# EasyEDA Pro project 视觉车.eprj, board motor2
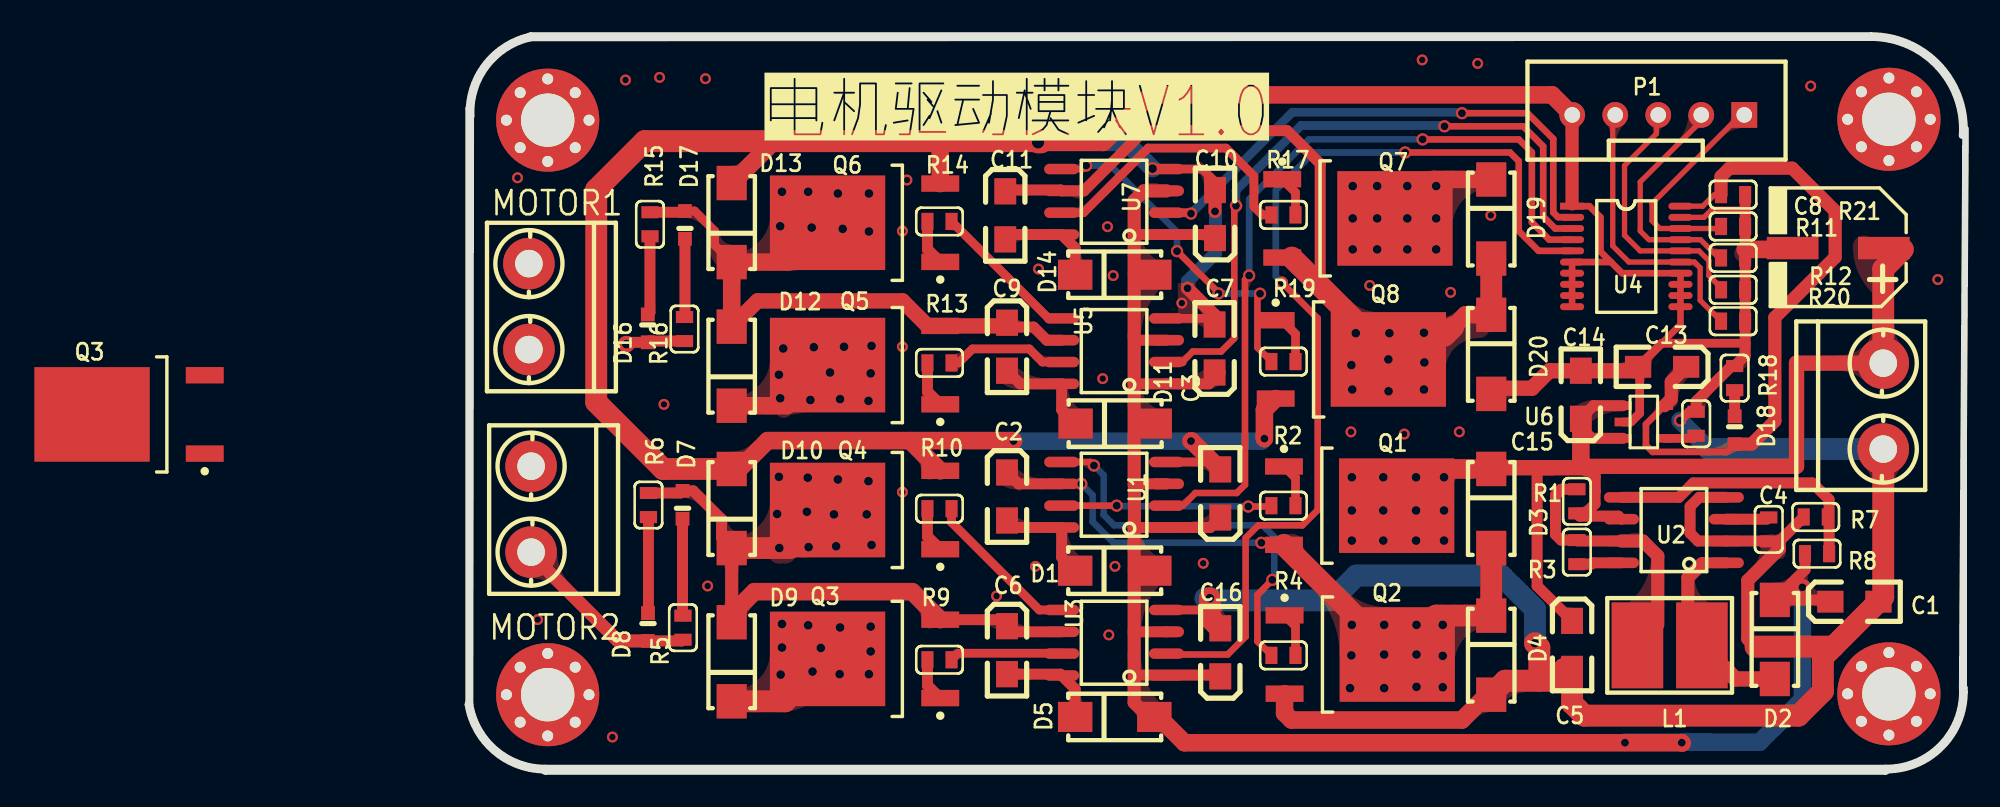
[diagram p3: board, top side]
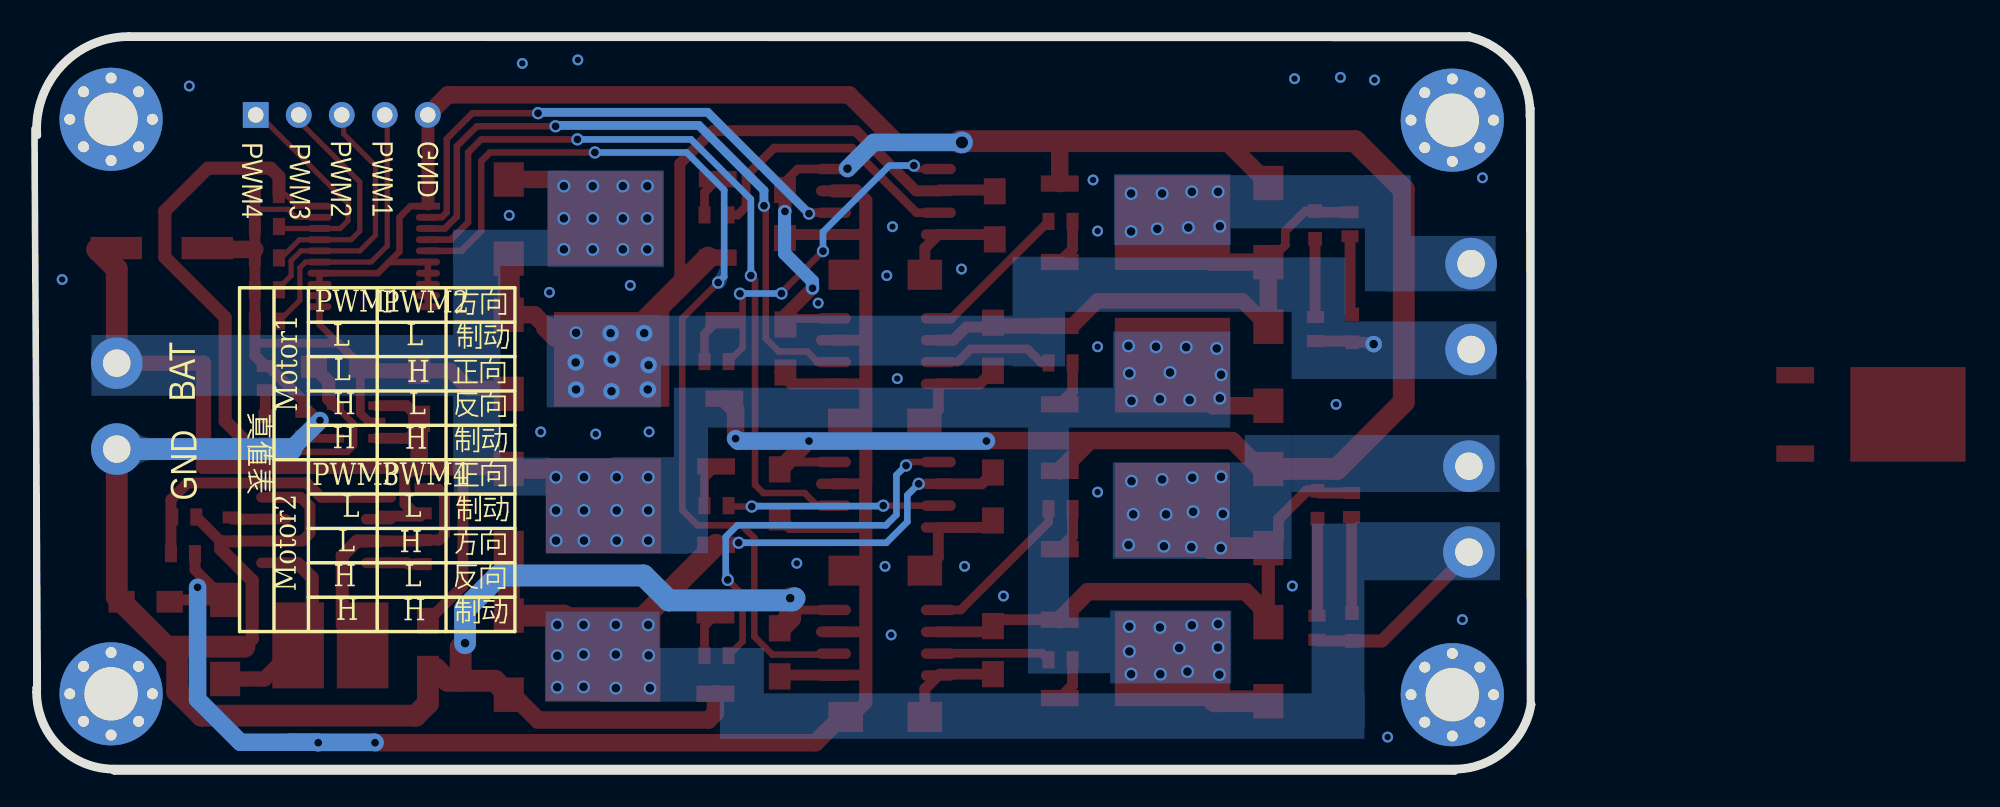
[diagram p4: board, bottom side, seen from below]

Outline 87.11 x 42.95 mm; copper layers: Top Layer, Bottom Layer. Coordinates in mm from the lower left corner of the outline.
Outline path: 0.23,38.62 0.19,3.98 arc(1.7,1.31) 4.57,0.27 82.45,0.27 arc(85.69,1.63) 86.91,4.92 87.11,37.45 ; 0.26,38.19 arc(1.16,41.1) 3.72,42.74 81.59,42.76 arc(85.49,41.07) 86.9,37.06 ; 87.11,37.45 arc(85.51,41.33) 81.64,42.95 arc(81.62,42.95) 81.61,42.95 3.72,42.95 arc(3.66,42.94) 3.6,42.91 arc(1.15,41.4) 0.07,38.72 arc(0.05,38.67) 0.04,38.62 0.04,4.1 arc(0,4.03) 0,3.95 arc(1.51,1.22) 4.42,0.08 arc(4.49,0.02) 4.57,0 82.45,0 arc(82.54,0.02) 82.61,0.08 arc(85.8,1.47) 87.11,4.69 arc(87.11,4.81) 87.1,4.93 arc(87.09,4.99) 87.06,5.04 87.06,36.95 arc(87.08,37) 87.09,37.05 arc(87.11,37.25) 87.11,37.45
Stack: Top Layer 0.0356mm / Dielectric1 0.32mm FR-4 er 4.8 / Bottom Layer 0.0356mm

## Design rules (mm)
spacing Clearance (default): track to track 0.203, other pairs 0 to 0.203
track width Width (default): min 0.254, default 0.305, max 3.048
track width POWER: min 0.254, default 0.508, max 5.08
track width GND: min 0.254, default 0.508, max 5.08
differential pair DiffPairsRouting (default): width min 0.381, default 0.381, max 0.381; gap min 0.254, default 0.254
via RoutingVias (default): diameter min 0.406, default 0.508, max 1.27; hole min 0.254, default 0.305, max 1.118

## Placement (name value [footprint] x y rotation side)
C1  Cap Pol1  [3216]  80.65 9.94 180 top
C2  1.5uF  [3216]  31.4 16.07 90 top
C3  Cap Pol1  [3216]  43.79 16.24 270 top
C4  470pF  [0603AR]  75.67 13.45 90 top
C5  Cap Pol1  [3216]  64.24 7.43 90 top
C6  1.5uF  [3216]  31.4 7.12 90 top
C7  Cap Pol1  [3216]  43.46 24.68 270 top
C8  100nF  [0603AR]  74.3 33.63 180 top
C9  1.5uF  [3216]  31.4 24.78 90 top
C10  Cap Pol1  [3216]  43.49 32.5 270 top
C11  1.5uF  [3216]  31.29 32.42 90 top
C13  10uF  [3216]  69.47 23.61 0 top
C14  10uF  [3216]  64.75 21.98 270 top
C15  470pF  [0603AR]  71.45 19.6 90 top
C16  Cap Pol1  [3216]  43.79 7 270 top
D1  IN5819  [DO-214  贴片二极管]  39.96 11.75 180 top
D2  IN5819  [DO-214  贴片二极管]  76.02 5.45 90 top
D3  IN5819  [DO-214  贴片二极管]  59.54 13.07 90 top
D4  IN5819  [DO-214  贴片二极管]  59.54 4.53 90 top
D5  IN5819  [DO-214  贴片二极管]  39.96 3.24 180 top
D7  RED  [LED_0603]  12.59 16.73 270 top
D8  RED  [LED_0603]  10.48 7.33 90 top
D9  IN5819  [DO-214  贴片二极管]  15.39 8.75 270 top
D10  IN5819  [DO-214  贴片二极管]  15.39 17.67 270 top
D11  IN5819  [DO-214  贴片二极管]  39.98 20.31 180 top
D12  IN5819  [DO-214  贴片二极管]  15.39 25.95 270 top
D13  IN5819  [DO-214  贴片二极管]  15.39 34.3 270 top
D14  IN5819  [DO-214  贴片二极管]  39.96 28.97 180 top
D16  RED  [LED_0603]  10.47 24.7 90 top
D17  RED  [LED_0603]  12.73 33.01 270 top
D18  RED  [LED_0603]  73.64 18.78 90 top
D19  IN5819  [DO-214  贴片二极管]  59.54 29.91 90 top
D20  IN5819  [DO-214  贴片二极管]  59.54 22.03 90 top
DESIGNATOR19  -  [CAP6.3X7.7]  79.71 30.52 180 top
L1  Inductor  [屏蔽电感5X5]  70.28 7.4 0 top
MOTOR1  Motor  [Con 2接线端子]  3.61 27.12 270 top
MOTOR2  Motor  [Con 2接线端子]  3.74 15.33 270 top
NOREF  -  [Mech Hole 1_1]  4.7 4.53 270 top
NOREF#2  -  [Mech Hole 1_3]  4.7 37.96 270 top
NOREF#3  -  [Con 2接线端子]  82.32 21.32 90 top
NOREF#4  -  [Mech Hole 1_2]  82.65 38.01 270 top
NOREF#5  -  [Mech Hole 1]  82.65 4.59 270 top
P1  Header 5  [CZ5-2.54]  74.25 38.27 180 top
Q1  -  [TO-252  mos管]  51.89 15.53 0 top
Q2  -  [TO-252  mos管]  51.93 6.87 0 top
Q3  -  [TO-252  mos管]  23.12 6.62 180 top
Q3#2  -  [TO-252  mos管]  -19.63 20.84 180 top
Q4  -  [TO-252  mos管]  23.12 15.28 180 top
Q5  -  [TO-252  mos管]  23.12 23.71 180 top
Q6  -  [TO-252  mos管]  23.12 31.99 180 top
Q7  -  [TO-252  mos管]  51.79 32.25 0 top
Q8  IR7843  [TO-252  mos管]  51.41 24.04 0 top
R1  Res2  [0603AR]  64.52 15.09 90 top
R2  Res2  [0603AR]  46.76 15.53 0 top
R3  Res2  [0603AR]  64.52 12.13 90 top
R4  Res2  [0603AR]  46.76 6.82 0 top
R5  Res2  [0603AR]  12.56 9.13 270 top
R6  Res2  [0603AR]  10.56 16.27 270 top
R7  Res2  [0603AR]  77.7 14.87 0 top
R8  Res2  [0603AR]  77.78 12.74 0 top
R9  Res2  [0603AR]  28.17 6.57 180 top
R10  Res2  [0603AR]  28.17 15.35 180 top
R11  Res2  [0603AR]  74.3 31.78 180 top
R12  Res2  [0603AR]  74.3 29.95 180 top
R13  Res2  [0603AR]  28.17 23.84 180 top
R14  Res2  [0603AR]  28.17 32.07 180 top
R15  Res2  [0603AR]  10.64 31.2 90 top
R16  Res2  [0603AR]  12.65 25.11 90 top
R17  Res2  [0603AR]  46.76 32.45 0 top
R18  Res2  [0603AR]  73.69 23.65 270 top
R19  Res2  [0603AR]  46.76 23.91 0 top
R20  Res2  [0603AR]  74.3 28.09 180 top
R21  Res2  [0603AR]  74.3 26.26 180 top
U1  IR2104S  [SO8NB]  37.62 16.17 90 top
U2  MC34063  [SO8NB]  70.16 14.11 90 top
U3  IR2104S  [SO8NB]  37.62 7.56 90 top
U4  74lvc245  [74lvc245 TSSOP]  64.24 32.96 0 top
U5  IR2104S  [SO8NB]  37.62 24.52 90 top
U6  MIC5219  [SOT23-5 - duplicate]  67.21 21.35 90 top
U7  IR2104S  [SO8NB]  37.62 33.21 90 top

## Footprints (pads in the part's own frame, mm; a bottom-side part is the same pattern mirrored in y, then rotated)
74lvc245 TSSOP
  rect 1.4x0.4 smd: 1(0,0)
  oval 1.4x0.4 smd: 2(0,-0.65) 3(0,-1.3) 4(0,-1.95) 5(0,-2.6) 6(0,-3.25) 7(0,-3.9) 8(0,-4.55) 9(0,-5.2) 10(0,-5.85) 11(6.3,-5.85) 12(6.3,-5.2) 13(6.3,-4.55) 14(6.3,-3.9) 15(6.3,-3.25) 16(6.3,-2.6) 17(6.3,-1.95) 18(6.3,-1.3) 19(6.3,-0.65) 20(6.3,0)
0603AR
  rect 0.7x1 smd: 1(0,0) 2(1.4,0)
3216
  rect 1.524x1.27 smd: 1(1.397,0) 2(-1.397,0)
CAP6.3X7.7
  rect 3x1.3 smd: 1(-2.65,0) 2(2.65,0)
Con 2接线端子
  round 3 hole 1.6: 1(-2.5,0) 2(2.5,0)
CZ5-2.54
  rect 1.5x1.5 hole 0.9: 1(0,0)
  round 1.5 hole 0.9: 2(2.5,0) 3(5,0) 4(7.5,0) 5(10,0)
DO-214  贴片二极管
  rect 2x1.75 smd: 1(0,0) 2(4.6,0)
LED_0603
  rect 0.8x0.8 smd: 1(0.333,-0.051) 2(1.953,-0.051)
Mech Hole 1
  round 0.635 hole 0.635: 1(-2.4,0) 1(-1.6,1.6) 1(-1.6,-1.6) 1(0,2.4) 1(0,-2.4) 1(1.6,1.6) 1(1.6,-1.6) 1(2.4,0)
  round 6 hole 3.1: 3(0,0)
Mech Hole 1_1
  round 0.635 hole 0.635: 1(-2.4,0) 1(-1.6,1.6) 1(-1.6,-1.6) 1(0,2.4) 1(0,-2.4) 1(1.6,1.6) 1(1.6,-1.6) 1(2.4,0)
  round 6 hole 3.1: 4(0,0)
Mech Hole 1_2
  round 0.635 hole 0.635: 1(-2.4,0) 1(-1.6,1.6) 1(-1.6,-1.6) 1(0,2.4) 1(0,-2.4) 1(1.6,1.6) 1(1.6,-1.6) 1(2.4,0)
  round 6 hole 3.1: 2(0,0)
Mech Hole 1_3
  round 0.635 hole 0.635: 1(-2.4,0) 1(-1.6,1.6) 1(-1.6,-1.6) 1(0,2.4) 1(0,-2.4) 1(1.6,1.6) 1(1.6,-1.6) 1(2.4,0)
  round 6 hole 3.1: 1(0,0)
SO8NB
  oval 0.61x2.032 smd: 1(-1.905,-3.048) 2(-0.635,-3.048) 3(0.635,-3.048) 4(1.905,-3.048) 5(1.905,3.048) 6(0.635,3.048) 7(-0.635,3.048) 8(-1.905,3.048)
SOT23-5 - duplicate
  rect 0.5x1 smd: 1(0,0) 2(-0.95,0) 3(-1.9,0) 4(-1.9,-2.4) 5(0,-2.4)
TO-252  mos管
  rect 2.2x0.95 smd: 1(-4.4,2.28) 3(-4.4,-2.28)
  rect 6.7x5.5 smd: 4(2.15,0)
屏蔽电感5X5
  rect 3x5 smd: 1(-2.25,0) 2(1.5,0)

## Nets
3.3V: C8.2 C13.1 D18.1 U4.20 U6.5
12V: C1.1 C3.1 C7.1 C10.1 C16.1 D1.1 D2.2 D5.1 D11.1 D14.1 R8.1 U1.1 U1.3 U3.1 U3.3 U5.1 U5.3 U7.1 U7.3
GND: C1.2 C3.2 C4.1 C5.2 C7.2 C8.1 C10.2 C13.2 C14.2 C15.2 C16.2 D4.1 D10.1 D13.1 D20.1 DESIGNATOR19.2 NOREF#3.1 P1.5 Q2.3 Q4.3 Q6.3 Q8.3 R7.1 R11.1 R12.1 R18.1 R20.1 R21.1 U1.4 U2.2 U2.4 U3.4 U4.1 U4.6 U4.7 U4.8 U4.9 U4.10 U4.11 U4.12 U4.13 U4.14 U4.19 U5.4 U6.2 U7.4
BAT: C5.1 C14.1 D3.2 D9.2 D12.2 D19.2 DESIGNATOR19.1 NOREF#3.2 Q1.4 Q3.4 Q3#2.4 Q5.4 Q7.4 R1.1 U2.6 U6.1 U6.3
MOTOR IN1: U4.3 U5.2
MOTOR IN2: U4.2 U7.2
MOTOR IN3: U1.2 U4.4
MOTOR IN4: U3.2 U4.5
NETB1_1: C2.1 D3.1 D4.2 D8.1 MOTOR2.2 Q1.3 Q2.4 R5.2 U1.6
NETB1_2: C6.1 D7.1 D9.1 D10.2 MOTOR2.1 Q3.3 Q3#2.3 Q4.4 R6.1 U3.6
NETB2_1: C9.1 D12.1 D13.2 D17.1 MOTOR1.1 Q5.3 Q6.4 R15.2 U5.6
NETB2_2: C11.1 D16.1 D19.1 D20.2 MOTOR1.2 Q7.3 Q8.4 R16.1 U7.6
NETC2_2: C2.2 D1.2 U1.8
NETC4_2: C4.2 U2.3
NETC6_2: C6.2 D5.2 U3.8
NETC9_2: C9.2 D11.2 U5.8
NETC11_2: C11.2 D14.2 U7.8
NETC15_1: C15.1 U6.4
NETD2_1: D2.1 L1.2 U2.1
NETD7_2: D7.2 R5.1
NETD8_2: D8.2 R6.2
NETD16_2: D16.2 R15.1
NETD17_2: D17.2 R16.2
NETD18_2: D18.2 R18.2
NETL1_1: L1.1 R1.2 R3.2 U2.7
NETQ1_1: Q1.1 R2.2
NETQ2_1: Q2.1 R4.2
NETQ3_1: Q3.1 Q3#2.1 R9.2
NETQ4_1: Q4.1 R10.2
NETQ5_1: Q5.1 R13.2
NETQ6_1: Q6.1 R14.2
NETQ7_1: Q7.1 R17.2
NETQ8_1: Q8.1 R19.2
NETR2_1: R2.1 U1.7
NETR3_1: R3.1 U2.8
NETR4_1: R4.1 U1.5
NETR7_2: R7.2 R8.2 U2.5
NETR9_1: R9.1 U3.7
NETR10_1: R10.1 U3.5
NETR13_1: R13.1 U5.7
NETR14_1: R14.1 U5.5
NETR17_1: R17.1 U7.7
NETR19_1: R19.1 U7.5
PWM1: P1.4 R21.2 U4.15
PWM2: P1.3 R20.2 U4.16
PWM3: P1.2 R12.2 U4.17
PWM4: P1.1 R11.2 U4.18

Pads without a net: NOREF 1 4; NOREF#2 1; NOREF#4 1 2; NOREF#5 1 3

## Via types
v1: diameter 0.635, hole 0.381, Top Layer to Bottom Layer, 32 vias
v2: diameter 0.711, hole 0.457, Top Layer to Bottom Layer, 24 vias
v3: diameter 0.965, hole 0.508, Top Layer to Bottom Layer, 11 vias
v4: diameter 0.762, hole 0.508, Top Layer to Bottom Layer, 80 vias
v5: diameter 1.27, hole 0.711, Top Layer to Bottom Layer, 1 via
v6: diameter 0.965, hole 0.457, Top Layer to Bottom Layer, 3 vias

## Routing (per net, layer and track width the routed paths; a pad name or vN(x,y) marks a point on that pad's centre or on a via; arc(x,y) is an arc through that point)
3.3V: length 38.8
  Top Layer w0.305: 72.51,33.63 71.83,32.96 70.54,32.96
  Top Layer w0.381: U6.5 68.53,20.27 68.53,19.05 68.93,18.66 73.23,18.66 D18.1
  Top Layer w0.762: D18.1 74.67,19.11 76.02,20.46 76.02,26.48 79.53,29.98 79.53,32.67 77.03,35.17 73.38,35.17 72.9,34.68 C8.2 ; C13.1 70,22.75 70,21.74 U6.5
12V: length 120.1
  Top Layer w0.635: 41.28,8.19 U3.3 38.79,8.19 ; D2.2 76.89,10.05 v6(77.62,10.78) ; D2.2 77.78,11.8 R8.1 ; D2.2 79.15,10.05 C1.1 ; 38.79,22.62 U5.1 43.13,22.62 43.79,23.28 ; 38.8,16.76 38.79,16.78 38.81,16.8 U1.3 40.06,16.8 ; U7.3 41.28,33.85 ; 38.8,14.21 38.79,14.2 38.85,14.26 U1.1 43.21,14.26 C3.1 ; 38.83,5.68 43.79,5.68 ; U5.3 39.04,25.16 38.79,25.41 ; 43.79,31.33 43.79,31.28 43.77,31.31 U7.1 38.99,31.31 38.79,31.51
  Top Layer w0.762: 38.8,14.21 38.8,16.76 ; 38.79,16.78 38.79,33.29 39.35,33.85 U7.3 ; 38.79,14.2 38.79,4.08 39.55,3.31
  Top Layer w1.016: D5.1 40.24,2.96 40.49,2.96 41.71,1.74 v6(70.61,1.74) 70.64,1.72
  Bottom Layer w1.016: 72.26,1.77 75.14,1.77 77.62,4.26 v6(77.62,10.78) ; 72.26,1.77 67.34,1.77 v6(67.31,1.74) ; 72.26,1.77 70.64,1.77 v6(70.61,1.74)
GND: length 349
  Top Layer w0.305: 74.3,32.73 74.25,32.77 72.37,32.77 71.9,32.31 70.54,32.31
  Top Layer w0.381: U4.1 65.24,32.96 65.89,32.31 65.89,30.31 66.5,29.71 ; U4.10 U4.9 U4.8 U4.7 U4.6 66.5,29.71 ; 66.5,29.71 67.15,29.06 70.54,29.06 70.54,26.07 69.45,24.98
  Top Layer w0.508: v2(70.51,20.49) 71.02,21 C15.2 ; 43.79,34.07 42.75,35.12 U7.4 ; C13.2 69.45,24.98 74.3,24.98 ; U1.4 43.36,18.07 C3.2 ; U3.4 42.72,9.46 43.18,9 ; 43.63,26.24 43.79,26.07 ; U5.4 43.44,26.43 ; U6.2 67.66,20.4 68.17,20.91 68.17,23.06 67.85,23.38
  Top Layer w0.635: 75.64,13.48 U2.2 71.55,13.48 71.1,13.93 71.1,15.48 71.63,16.02 U2.4 ; C8.1 R11.1 74.3,30.44 ; C4.1 76.28,13.45 R7.1 ; C15.2 71.45,21.6 73.5,23.65 R18.1 74.3,24.26 R21.1 R20.1 R12.1
  Top Layer w0.762: 74.9,7.33 74.45,7.78 74.45,11.18 76.28,13 76.28,13.45 ; v2(43.49,32.65) C10.2 ; v2(41.89,28.18) 43.46,26.61 C7.2 ; 64.24,33.09 64.24,38.55
  Top Layer w0.889: D20.1 59.87,22.37 61.9,22.37 62.92,23.38 C14.2 67.85,23.38 C13.2
  Top Layer w1.016: Q6.3 27.52,36.67 v5(33.2,36.67) ; C3.2 42.14,19.29 v2(42.09,19.29) ; Q8.3 46.36,21.11 v2(46.36,19.43) ; 33.38,36.67 36.98,36.67 39.75,39.43 63.08,39.43 P1.5 ; D4.1 59.31,4.53 57.84,3.06 47.93,3.06 47.53,3.46 Q2.3 ; 74.3,30.44 76.61,30.44 ; D10.1 15.83,17.67 17.48,19.32 25.76,19.32 ; 25.76,19.32 Q4.3 ; 25.76,19.32 31.75,19.32 v2(31.78,19.29) ; 26.67,36.69 17.81,36.69 15.42,34.3 D13.1
  Top Layer w1.27: 74.9,7.33 79.43,7.33 ; 79.43,7.33 C1.2 82.32,10.22 NOREF#3.1 ; 79.43,7.33 78.82,6.72 78.82,4.73 77.4,3.31 64.95,3.31 64.24,4.03 C5.2 63.78,6.03 63.1,5.35 62.33,5.35 ; 62.33,5.35 60.35,5.35 D4.1 ; 62.33,5.35 62.33,7.28 v3(62.08,7.53) ; v3(43.18,10.15) 43.18,9 C16.2 ; 33.38,36.67 33.3,36.74 10.34,36.74 7.52,33.92 7.52,21.55 11.41,17.67 D10.1
  Bottom Layer w0.762: v2(41.89,28.18) 41.89,28.59 43.51,30.21 43.51,32.63 v2(43.49,32.65)
  Bottom Layer w1.016: v2(46.36,19.43) 46.22,19.29 v2(42.09,19.29) v2(31.78,19.29) ; v5(33.2,36.67) 38.33,36.67 v4(39.85,35.14) ; v2(70.51,20.49) 72.17,18.82
  Bottom Layer w1.27: NOREF#3.1 72.17,18.82 ; 42.93,10.15 43.06,10.02 50.25,10.02 51.7,11.47 60.12,11.47 62.08,9.51 v3(62.08,7.53)
  vias: v1(2.95,34.61) v1(4.12,8.9) v1(8.46,2.07) v1(9.22,40.3) v1(11.2,40.45) v1(11.46,21.42) v1(13.87,40.37) v1(14,10.86) v1(25.32,31.51) v1(25.32,24.78) v1(25.32,16.32) v1(25.58,34.48) v1(30.79,10.27) v1(33.05,12) v1(33.23,29.3) v1(36.96,22.92) v1(37.24,31.76) v1(37.31,8.01) v1(37.57,28.92) v1(37.67,12) v1(41.56,27.32) v1(42.8,12.18) v1(51.39,19.83) v1(52.48,28.35) v1(54.48,19.7) v1(55.53,41.47) v1(57.18,27.94) v1(57.69,19.83) v1(58.75,41.26) v1(59.51,32.42) v1(78.11,39.95) v1(85.5,28.69)
BAT: length 87.4
  Top Layer w0.635: 62.51,17.74 62.21,17.44 62.21,10.86 C5.1 ; 65.08,17.74 65.59,17.23 65.59,16.37 65.57,16.36 65.57,15.63 65.02,15.09 R1.1 64.68,14.92 66.93,14.92 U2.6 ; U6.1 65.48,21.35 64.75,20.61 C14.1 64.75,20.08 65.38,19.45 U6.3
  Top Layer w0.889: NOREF#3.2 77.28,23.82 77.28,17.82 65.15,17.82 65.08,17.74 62.51,17.74 ; 58.47,17.67 58.54,17.74 63.15,17.74
  Top Layer w1.016: D12.2 18.6,21.35 Q5.4 ; D19.2 56.21,34.51 53.94,32.25 ; 64.75,20.08 64.75,18.07 65.08,17.74
  Top Layer w1.143: Q1.4 56.18,17.67 58.47,17.67
  Top Layer w1.27: 83.47,30.44 82.32,29.3 NOREF#3.2 ; Q3.4 18.5,4.15 D9.2
  vias: v4(18.14,23.15) v4(18.21,21.78) v4(18.24,5.7) v4(18.39,24.68) v4(18.32,8.65) v4(18.32,7.28) v4(19.84,8.57) v4(19.97,21.68) v4(20.09,5.88) v4(20.17,24.75) v4(20.58,7.25) v4(21.11,23.28) v4(21.69,21.73) v4(21.69,8.45) v4(21.67,5.73) v4(21.92,24.78) v4(23.34,21.63) v4(23.37,5.73) v4(23.47,23.23) v4(23.47,8.5) v4(23.47,7.05) v4(23.52,24.83) v4(51.49,34.12) v4(51.49,32.25) v4(51.49,30.44) v4(51.44,17.18) v4(51.44,15.25) v4(51.44,13.5) v4(52.91,34.12) v4(52.91,32.25) v4(52.91,30.44) v4(53.27,17.18) v4(53.27,15.25) v4(53.27,13.5) v4(54.66,34.12) v4(54.66,32.25) v4(54.66,30.44) v4(55.17,17.18) v4(55.17,15.25) v4(55.17,13.5) v4(56.34,34.12) v4(56.34,32.25) v4(56.34,30.44) v4(56.8,17.18) v4(56.8,15.25) v4(56.8,13.5)
MOTOR IN1: length 39.2
  Top Layer w0.381: 44.88,32.98 44.6,32.7 44.6,25.26 43.84,24.5 42.19,24.5 41.58,23.89 ; U4.3 63.26,31.66 62.56,32.35 62.56,36.44 61.39,37.61 v2(56.82,37.61)
  Top Layer w0.508: U5.2 41.58,23.89
  Bottom Layer w0.508: v2(44.71,32.98) 44.71,33.87 48.49,37.66 56.77,37.66 v2(56.82,37.61)
MOTOR IN2: length 31.1
  Top Layer w0.381: U4.2 64.23,32.32 63.42,32.32 63.14,32.59 63.14,36.87 61.65,38.37 v2(57.84,38.37)
  Top Layer w0.508: 40.67,32.58 42.04,32.58 v2(42.09,32.53)
  Bottom Layer w0.508: v2(42.09,32.53) 47.98,38.42 57.79,38.42 v2(57.84,38.37)
MOTOR IN3: length 46.8
  Top Layer w0.381: U4.4 62.91,31.01 61.9,32.02 61.9,36.08 61.14,36.84 v2(55.55,36.84) ; U1.2 41.61,15.53 42.34,16.27 44.75,16.27 45.23,16.75 45.23,28.68 v2(45.47,28.92)
  Bottom Layer w0.381: v2(55.55,36.84) 48.95,36.84 45.47,33.36 v2(45.47,28.92)
MOTOR IN4: length 58.2
  Top Layer w0.381: U4.5 62.29,30.36 61.14,31.51 61.14,35.57 60.63,36.08 v2(54.54,36.08) ; v2(47.37,28.51) 47.37,28.5 47.56,28.31 47.57,28.31 49.46,26.43 49.46,15.28 48.57,14.39 46,14.39 45.26,13.65 45.26,7.91 44.22,6.87 40.72,6.87 U3.2
  Bottom Layer w0.381: v2(47.37,28.51) 47.02,28.86 47.02,33.9 49.2,36.08 v2(54.54,36.08)
NETB1_1: length 49.4
  Top Layer w0.381: U1.6 v2(35.71,16.8) ; v2(46.18,13.37) 47.37,13.37 Q1.3
  Top Layer w0.635: U1.6 32.06,16.8 C2.1 ; D8.1 12.49,7.66 R5.2
  Top Layer w0.762: D8.1 8.79,7.66 3.74,12.71 MOTOR2.2
  Top Layer w1.27: D3.1 D4.2 56.34,9.13 Q2.4 53.88,6.87 Q1.3
  Bottom Layer w0.381: v2(46.18,13.37) 37.59,13.37 36.38,14.59 36.38,16.14 v2(35.71,16.8)
  vias: v4(51.34,4.92) v4(51.44,8.6) v4(51.41,6.82) v4(53.32,8.6) v4(53.32,6.87) v4(53.32,4.92) v4(55.2,8.6) v4(55.2,6.87) v4(55.2,4.99) v4(56.72,8.6) v4(56.72,6.8) v4(56.72,4.97)
NETB1_2: length 39.3
  Top Layer w0.635: U3.6 31.73,8.19 C6.1 31.02,8.9 Q3.3 28.38,8.9 ; R6.1 12.41,16.27 D7.1 13.16,16.39 14.81,14.75 14.81,13.66 D10.2
  Top Layer w0.762: D9.1 D10.2
  Top Layer w1.016: 15.39,9.21 16.72,10.53 25.88,10.53 Q3.3
  Top Layer w1.27: Q4.4 18.75,13.07 D10.2
  vias: v4(18.04,15.05) v4(18.14,17.21) v4(18.16,13.07) v4(19.76,15.18) v4(19.81,17.16) v4(19.86,13.12) v4(21.34,15.02) v4(21.46,13.17) v4(21.57,17.06) v4(23.24,15.02) v4(23.34,16.95) v4(23.52,13.25)
NETB2_1: length 37.7
  Top Layer w0.508: D13.2 14.4,30.69 14.4,31.51 13.24,32.67 D17.1
  Top Layer w0.635: D17.1 12.61,32.6 R15.2 ; C9.1 31.65,25.92 32.95,25.92 33.71,25.16 U5.6
  Top Layer w0.889: C9.1 31.21,25.99 Q5.3 26.78,25.99 25.33,27.45 16.89,27.45 D12.1
  Top Layer w1.016: D12.1 D13.2 18.68,29.7 Q6.4
  vias: v4(18.21,31.79) v4(18.32,33.8) v4(19.84,33.8) v4(20.04,31.71) v4(21.57,33.69) v4(21.85,31.64) v4(23.37,33.69) v4(23.37,31.48)
NETB2_2: length 44.2
  Top Layer w0.635: 31.29,33.9 34.52,33.9 U7.6 35.87,33.85 39.37,37.35 47.68,37.35 49.6,35.43 49.6,28.32 ; v3(9.27,24.93) 9.38,25.03 D16.1 10.59,25.11 R16.1 ; 3.74,24.56 4.21,25.03
  Top Layer w0.889: Q7.3 47.95,29.97
  Top Layer w1.016: 57.33,25.92 58.04,26.64 D20.2
  Top Layer w1.27: 51.74,26.17 47.95,29.97 ; 56.82,25.41 57.33,25.92 ; D20.2 D19.1
  vias: v3(51.41,23.71) v3(51.46,22.29) v3(51.67,25.57) v3(53.56,24.04) v3(53.57,22.19) v3(53.62,25.57) v3(55.65,23.86) v3(55.63,22.29) v4(55.63,25.59)
NETC2_2: length 6.2
  Top Layer w0.635: C2.2 31.8,14.26 U1.8 34.57,12.53 D1.2
NETC4_2: length 2.4
  Top Layer w0.635: U2.3 75.56,14.75
NETC6_2: length 5.9
  Top Layer w0.635: 31.4,5.73 34.5,5.73 U3.8 35.36,4.87 D5.2
NETC9_2: length 6.1
  Top Layer w0.635: C9.2 32.16,22.62 U5.8 34.57,21.12 35.36,20.33
NETC11_2: length 6
  Top Layer w0.635: D14.2 35.36,30.52 U7.8 31.5,31.31 31.29,31.1
NETC15_1: length 1.9
  Top Layer w0.508: C15.1 71.31,19.45 U6.4
NETD2_1: length 11.9
  Top Layer w0.635: 71.78,12.16 71.83,12.21 U2.1
  Top Layer w0.762: L1.2 70.97,8.22 70.97,11.34 71.78,12.16
  Top Layer w0.889: D2.1 73.74,5.45 L1.2
NETD7_2: length 5.7
  Top Layer w0.635: R5.1 12.54,9.16 D7.2
NETD8_2: length 5.6
  Top Layer w0.635: R6.2 10.56,9.31 D8.2
NETD16_2: length 4.6
  Top Layer w0.635: R15.1 10.64,26.78 D16.2
NETD17_2: length 4.6
  Top Layer w0.635: R16.2 12.68,26.53 D17.2
NETD18_2: length 1.5
  Top Layer w0.635: D18.2 R18.2
NETL1_1: length 15.8
  Top Layer w0.635: L1.1 69.22,8.59 ; R1.2 63.62,16.49 63.27,16.14 63.27,13.86 63.6,13.53 R3.2 ; 64.57,13.48 U2.7
  Top Layer w0.762: 69.22,8.59 69.22,12.61 68.35,13.48 U2.7
NETQ1_1: length 2.6
  Top Layer w0.508: Q1.1 48.16,17.14 R2.2
NETQ2_1: length 2.6
  Top Layer w0.508: R4.2 48.16,8.52 Q2.1
NETQ3_1: length 2.5
  Top Layer w0.635: Q3.1 26.77,5.08 R9.2
NETQ4_1: length 2.7
  Top Layer w0.635: Q4.1 26.77,13.74 R10.2
NETQ5_1: length 2.7
  Top Layer w0.635: R13.2 26.77,22.18 Q5.1
NETQ6_1: length 2.7
  Top Layer w0.635: Q6.1 26.77,30.46 R14.2
NETQ7_1: length 2.4
  Top Layer w0.508: Q7.1 48.16,33.76 R17.2
NETQ8_1: length 2.6
  Top Layer w0.508: 47.44,26.25 48.16,25.53 R19.2
NETR2_1: length 12.4
  Top Layer w0.381: U1.7 37.9,15.53 37.92,15.51 ; R2.1 46.71,15.48 v2(45.42,15.48)
  Bottom Layer w0.381: v2(45.42,15.48) 45.39,15.51 37.92,15.51 37.9,15.53 v2(37.77,15.53)
NETR3_1: length 2.6
  Top Layer w0.635: R3.1 65.36,12.13 65.43,12.21 U2.8
NETR4_1: length 23.2
  Top Layer w0.381: v2(36.45,17.87) 36.25,18.07 U1.5 ; v2(46.81,11.21) 45.95,10.35 45.95,7.63 R4.1
  Bottom Layer w0.381: v2(46.81,11.21) 46.93,11.33 46.93,13.72 46.25,14.39 37.62,14.39 37.01,15 37.01,17.31 v2(36.45,17.87)
NETR7_2: length 16
  Top Layer w0.635: R8.2 79.18,15.89 78.21,16.85 71.28,16.85 70.44,16.02 U2.5
NETR9_1: length 6.6
  Top Layer w0.508: U3.7 34.55,6.95 28.55,6.95 R9.1
NETR10_1: length 9.3
  Top Layer w0.508: R10.1 28.17,14.57 33.27,9.46 U3.5
NETR13_1: length 7.1
  Top Layer w0.508: R13.1 28.58,23.84 29.39,24.65 32.69,24.65 33.45,23.89 U5.7
NETR14_1: length 8.7
  Top Layer w0.508: U5.5 33.81,26.43 R14.1
NETR17_1: length 16.4
  Top Layer w0.508: R17.1 46.23,32.45 45.75,32.93 45.75,34.71 44.12,36.34 39.6,36.34 35.84,32.58 34.57,32.58
NETR19_1: length 19.9
  Top Layer w0.381: U7.5 35.79,35.12 v2(35.99,35.32) ; v2(43.69,27.88) 43.69,27.93 v2(41.28,30.34) ; 46.89,24.04 R19.1 45.95,24.73 45.95,27.71
  Bottom Layer w0.381: v2(43.69,27.88) 45.86,27.88 45.99,27.75 ; v2(41.28,30.34) 41.28,31.46 37.42,35.32 v2(35.99,35.32) 36.27,35.32
  vias: v2(46.1,27.87)
PWM1: length 16.8
  Top Layer w0.305: R21.2 71.68,27.48 71.68,29.37 71.35,29.71 67.54,29.71 66.6,30.65 66.6,38.27
PWM2: length 14.9
  Top Layer w0.305: 69.14,38.09 69.14,37.17 67.29,35.32 67.29,31.26 68.19,30.36 71.61,30.36 72.19,29.78 72.19,28.91 72.82,28.28
PWM3: length 13.4
  Top Layer w0.305: P1.2 71.75,37.92 68.2,34.37 68.2,31.51 68.7,31.01 71.7,31.01 72.64,30.07 ; 72.82,30.06 72.82,30.07 ; R12.2 72.9,30.06
PWM4: length 12.4
  Top Layer w0.305: 73.98,38.53 73.98,38.2 68.89,33.11 68.89,32.11 69.34,31.66 72.52,31.66

## Copper pours and planes (outline as drawn; the poured copper is in the pictures)
GND on Top Layer: 87.56,-0.37 0.81,-0.37 -0.07,0.52 -0.07,43.19 87.05,43.19 87.56,42.69
GND on Top Layer: 41.33,28.48 42.37,28.48 42.37,26.12 41.33,26.12
GND on Bottom Layer: -0.2,43.19 87.43,43.19 87.56,43.32 87.56,-0.24 -0.07,-0.24 -0.2,-0.37
BAT on Bottom Layer: 50.52,35.04 57.28,35.04 57.28,29.4 50.52,29.4
BAT on Bottom Layer: 17.6,22.39 48.54,22.39 48.54,20.08 17.6,20.08
BAT on Bottom Layer: 60.02,31.56 62.77,31.56 62.77,17.31 60.02,17.31
BAT on Bottom Layer: 23.75,9.03 28.2,9.03 28.2,5.78 23.75,5.78
BAT on Bottom Layer: 26.98,20.79 29.36,20.79 29.36,5.77 26.98,5.77
BAT on Bottom Layer: 61.95,25.46 83.8,25.46 83.8,21.93 61.95,21.93
BAT on Bottom Layer: 57.2,18.33 62.74,18.33 62.74,16.12 57.2,16.12
BAT on Bottom Layer: 17.6,25.67 24.41,25.67 24.41,20.87 17.6,20.87
BAT on Bottom Layer: 47.96,22.39 49.94,22.39 49.94,12.76 47.96,12.76
BAT on Bottom Layer: 57.28,31.58 62.77,31.58 62.77,29.48 57.28,29.48
BAT on Bottom Layer: 50.65,18.3 57.38,18.3 57.38,12.74 50.65,12.74
BAT on Bottom Layer: 17.55,9.44 24.59,9.44 24.59,5.19 17.55,5.19
BAT on Bottom Layer: 49.1,18.35 53.55,18.35 53.55,12.74 49.1,12.74
NETB1_1 on Bottom Layer: 46.84,7.25 54.21,7.25 54.21,4.13 46.84,4.13
NETB1_1 on Bottom Layer: 50.78,9.36 57.41,9.36 57.41,4.18 50.78,4.18
NETB1_1 on Bottom Layer: 9.81,4.61 44.78,4.61 44.78,1.97 9.81,1.97
NETB1_1 on Bottom Layer: 9.81,14.49 12.88,14.49 12.88,2.63 9.81,2.63
NETB1_1 on Bottom Layer: 1.93,14.57 10.34,14.57 10.34,11.19 1.93,11.19
NETB1_1 on Bottom Layer: 44.72,7.25 47.27,7.25 47.27,1.97 44.72,1.97
NETB1_2 on Bottom Layer: 16.72,18.05 17.58,18.05 17.58,12.43 16.72,12.43
NETB1_2 on Bottom Layer: 17.58,18.05 24.44,18.05 24.44,12.43 17.58,12.43
NETB1_2 on Bottom Layer: 14.04,19.65 16.76,19.65 16.76,12.43 14.04,12.43
NETB1_2 on Bottom Layer: 1.96,19.65 14.04,19.65 14.04,16.32 1.96,16.32
NETB2_1 on Bottom Layer: 17.58,34.81 24.36,34.81 24.36,30.7 17.58,30.7
NETB2_1 on Bottom Layer: 8.64,34.76 17.88,34.76 17.88,31.66 8.64,31.66
NETB2_1 on Bottom Layer: 2.19,31.23 8.56,31.23 8.56,28 2.19,28
NETB2_1 on Bottom Layer: 7.11,34.76 9.78,34.76 9.78,28 7.11,28
NETB2_2 on Bottom Layer: 2.14,26.25 10.97,26.25 10.97,22.9 2.14,22.9
NETB2_2 on Bottom Layer: 11.03,29.97 27.21,29.97 27.21,26.81 11.03,26.81
NETB2_2 on Bottom Layer: 50.7,26.61 57.33,26.61 57.33,21.25 50.7,21.25
NETB2_2 on Bottom Layer: 28.37,26.58 50.75,26.58 50.75,23.69 28.37,23.69
NETB2_2 on Bottom Layer: 10.92,29.96 14.04,29.96 14.04,22.9 10.92,22.9
NETB2_2 on Bottom Layer: 27.21,30.01 30.25,30.01 30.25,23.64 27.21,23.64

Small or netless copper shapes (teardrops, artwork), in the pictures only: 677 on Top Layer, 53 on Bottom Layer

## Text on the board
Bottom Silkscreen Layer: 真值表 | Motor1 | Motor2 | PWM2 | PWM4 | PWM1 | PWM3 | GND | BAT | 制动 | 方向 | 正向 | 反向 | L | H
Top Silkscreen Layer: 电机驱动模块V1.0
